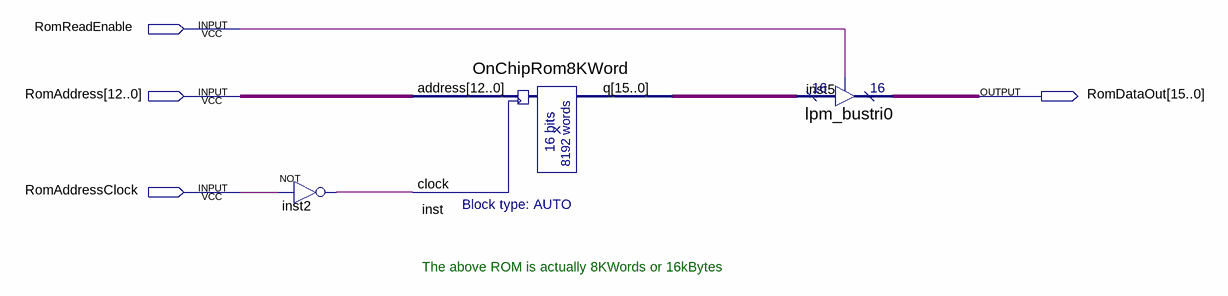
[diagram p0: schematic sheet]
// Quartus schematic OnChipROM4KWord.bdf as structural Verilog: 3 symbols, 4 pins
module OnChipROM4KWord (
  input  RomReadEnable,
  input  [12:0] RomAddress,
  input  RomAddressClock,
  output [15:0] RomDataOut
);

  wire inst2_out;
  wire [15:0] inst_q;

  not inst2 (inst2_out, RomAddressClock);
  OnChipRom8KWord inst (.address(RomAddress), .clock(inst2_out), .q(inst_q));
  lpm_bustri0 inst5 (.enabledt(RomReadEnable), .data(inst_q), .tridata(RomDataOut));

  // Notes on the sheet:
  //   The above ROM is actually 8KWords or 16kBytes
endmodule
